# Altium schematic sheet rev02_18.SchDoc
size 282 x 200 mm
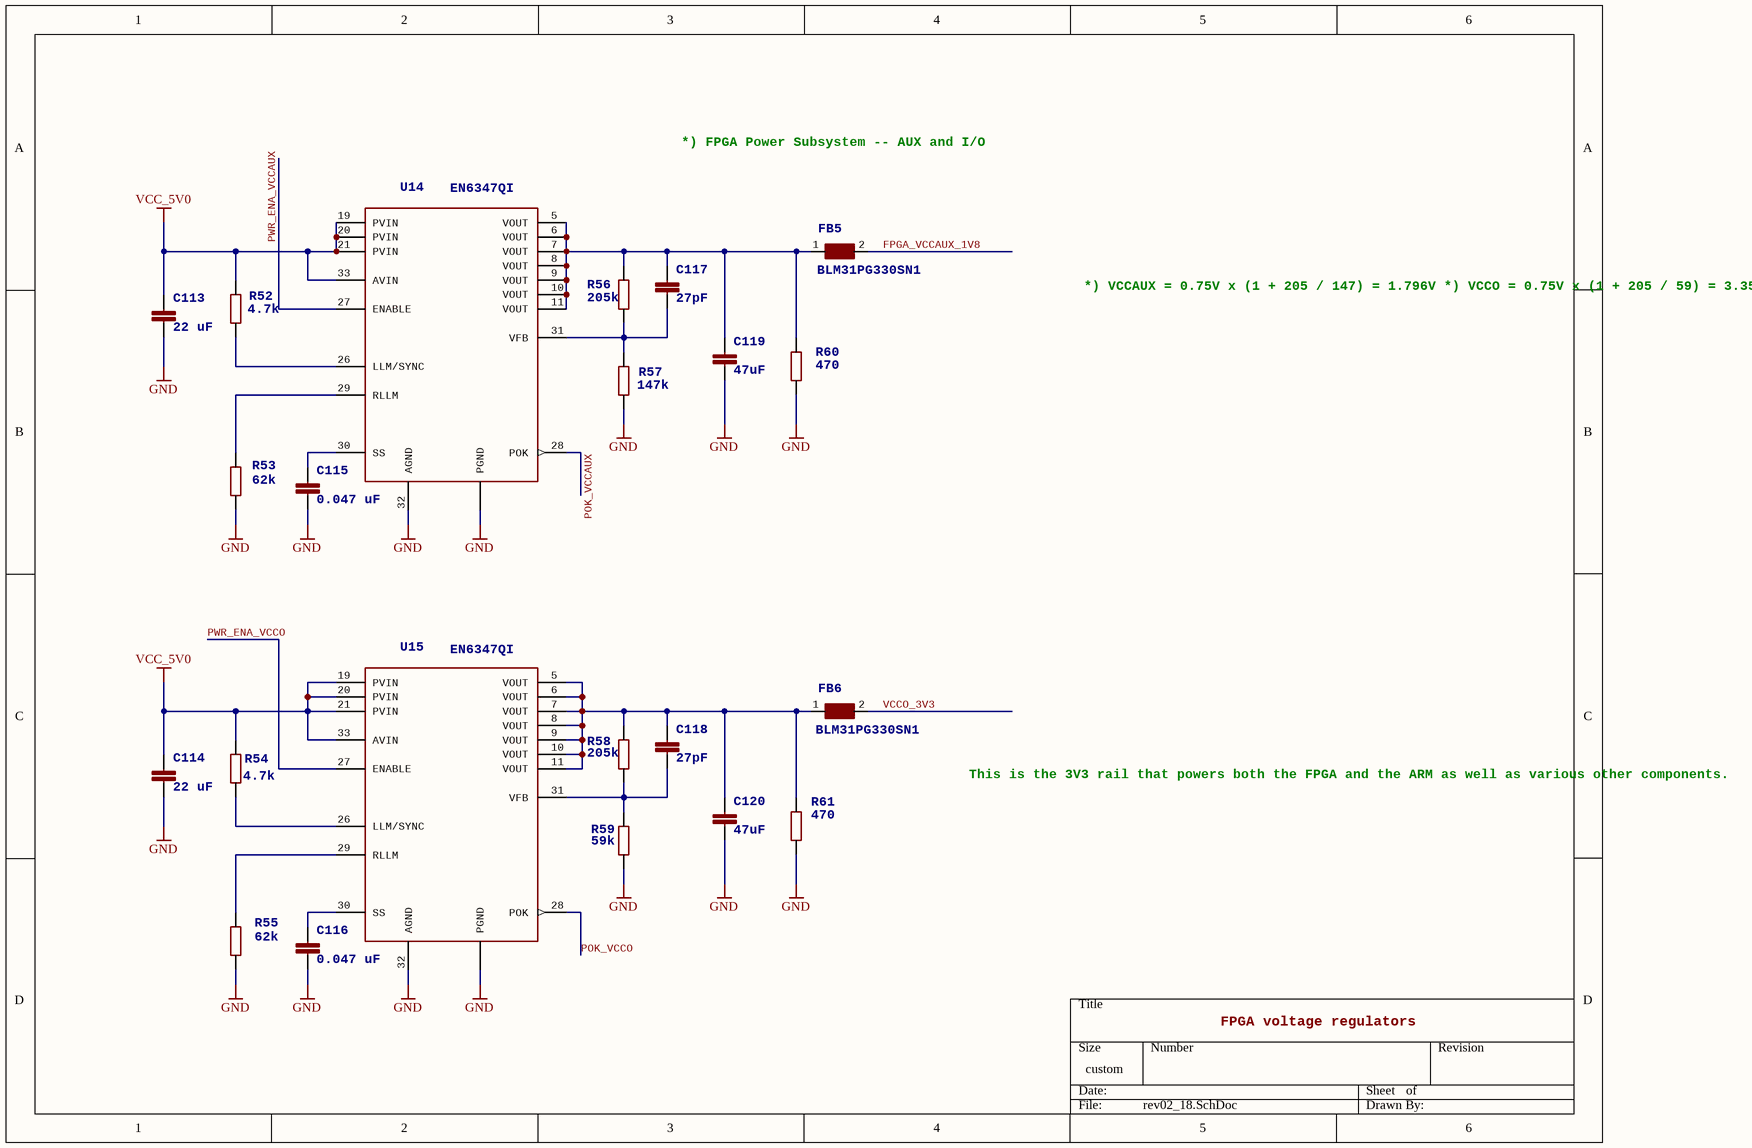
[diagram p0: rev02_18.SchDoc]

## Parts
C113  value 22 uF  >NAME: C113  [C_1210]  (hidden comment: C3225X5R1C226M250AA)
C114  value 22 uF  >NAME: C114  [C_1210]  (hidden comment: C3225X5R1C226M250AA)
C115  value 0.047 uF  >NAME: C115  [C_0402]
C116  value 0.047 uF  >NAME: C116  [C_0402]
C117  value 27pF  >NAME: C117  [C_0402]
C118  value 27pF  >NAME: C118  [C_0402]
C119  value 47uF  >NAME: C119  [C_1210]  (hidden comment: GRM32ER70J476ME20L)
C120  value 47uF  >NAME: C120  [C_1210]  (hidden comment: GRM32ER70J476ME20L)
FB5  BLM31PG330SN1  [L_1206]
FB6  BLM31PG330SN1  [L_1206]
R52  value 4.7k  >NAME: R52  [R_0402]
R53  value 62k  >NAME: R53  [R_0402]
R54  value 4.7k  >NAME: R54  [R_0402]
R55  value 62k  >NAME: R55  [R_0402]
R56  value 205k  >NAME: R56  [R_0402]
R57  value 147k  >NAME: R57  [R_0402]
R58  value 205k  >NAME: R58  [R_0402]
R59  value 59k  >NAME: R59  [R_0402]
R60  value 470  >NAME: R60  [R_0402]
R61  value 470  >NAME: R61  [R_0402]
U14  EN6347QI  [QFN38]
U15  EN6347QI  [QFN38]

## Nets
GND: C113.2 C114.2 C115.2 C116.2 C119.2 C120.2 R53.1 R55.1 R57.1 R59.1 R60.1 R61.1 U14.13(PGND) U14.14(PGND) U14.15(PGND) U14.16(PGND) U14.17(PGND) U14.18(PGND) U14.32(AGND) U14.PAD39(PGND) U15.13(PGND) U15.14(PGND) U15.15(PGND) U15.16(PGND) U15.17(PGND) U15.18(PGND) U15.32(AGND) U15.PAD39(PGND)
VCC_5V0: C113.1 C114.1 R52.2 R54.2 U14.19(PVIN) U14.20(PVIN) U14.21(PVIN) U14.33(AVIN) U15.19(PVIN) U15.20(PVIN) U15.21(PVIN) U15.33(AVIN)
FPGA_VCCAUX_1V8: FB5.2
POK_VCCAUX: U14.28(POK)
POK_VCCO: U15.28(POK)
PWR_ENA_VCCAUX: U14.27(ENABLE)
PWR_ENA_VCCO: U15.27(ENABLE)
VCCO_3V3: FB6.2
NetC115_1: C115.1 U14.30(SS)
NetC116_1: C116.1 U15.30(SS)
NetC117_1: C117.1 C119.1 FB5.1 R56.2 R60.2 U14.5(VOUT) U14.6(VOUT) U14.7(VOUT) U14.8(VOUT) U14.9(VOUT) U14.10(VOUT) U14.11(VOUT)
NetC117_2: C117.2 R56.1 R57.2 U14.31(VFB)
NetC118_1: C118.1 C120.1 FB6.1 R58.2 R61.2 U15.5(VOUT) U15.6(VOUT) U15.7(VOUT) U15.8(VOUT) U15.9(VOUT) U15.10(VOUT) U15.11(VOUT)
NetC118_2: C118.2 R58.1 R59.2 U15.31(VFB)
NetR52_1: R52.1 U14.26(LLM/SYNC)
NetR53_2: R53.2 U14.29(RLLM)
NetR54_1: R54.1 U15.26(LLM/SYNC)
NetR55_2: R55.2 U15.29(RLLM)

Not connected (* = marked no-connect by the designer): U14 1(NC) 2(NC) 3(NC) 4(NC) 12(NC) 22(NC) 23(NC) 24(NC) 25(NC) 34(NC) 35(NC) 36(NC) 37(NC) 38(NC); U15 1(NC) 2(NC) 3(NC) 4(NC) 12(NC) 22(NC) 23(NC) 24(NC) 25(NC) 34(NC) 35(NC) 36(NC) 37(NC) 38(NC)

## Notes on the sheet
- *) FPGA Power Subsystem -- AUX and I/O
- *) VCCAUX = 0.75V x (1 + 205 / 147) = 1.796V
  *) VCCO = 0.75V x (1 + 205 / 59) = 3.356
  *) Minimal load current is 2 mA:
  1.8V / 470 Ohm = ~4mA
  3.3V /  470 Ohm = ~7mA
  *) Light-load mode is enabled
- This is the 3V3 rail that powers
  both the FPGA and the ARM as well
  as various other components.
- FPGA voltage regulators

## Library data of the parts
C113 C114 = C-EUC1210: 1210 CAPACITOR; DIELECTRIC: X5R; RATED_VOLTAGE: 16V; TOLERANCE: 20%
C115 C116 = C-EUC0402: 0402 CAPACITOR; DIELECTRIC: X7R; RATED_VOLTAGE: 50V; TOLERANCE: 10%
C117 C118 = C-EUC0402: 0402 CAPACITOR; DIELECTRIC: C0G; RATED_VOLTAGE: 50V; TOLERANCE: 5%
C119 C120 = C-EUC1210: 1210 CAPACITOR X5R 6.3V; RATED_VOLTAGE: 16V; TOLERANCE: 20%; DIELECTRIC: X5R
FB5 FB6 = BLM31PG330SN1_1206
R52-R55 R60 R61 = R-EU_R0402: 0402 Resistor 5%; TOLERANCE: 5%
R56-R59 = R-EU_R0402: 0402 Resistor 1%; TOLERANCE: 1%
U14 U15 = EN6347QI: 3A PowerSoC / Voltage Mode Synchronous PWM Buck with Integrated Inductor; >NAME: U14; MPN: EN6347QI; OC_FARNELL: 2081146; PACKAGE: QFN; SUPPLIER: ENPIRION; >VALUE: EN6347QI